# EAGLE design a4989_smoothiebrain_daughterboard (EAGLE 7.5.0)
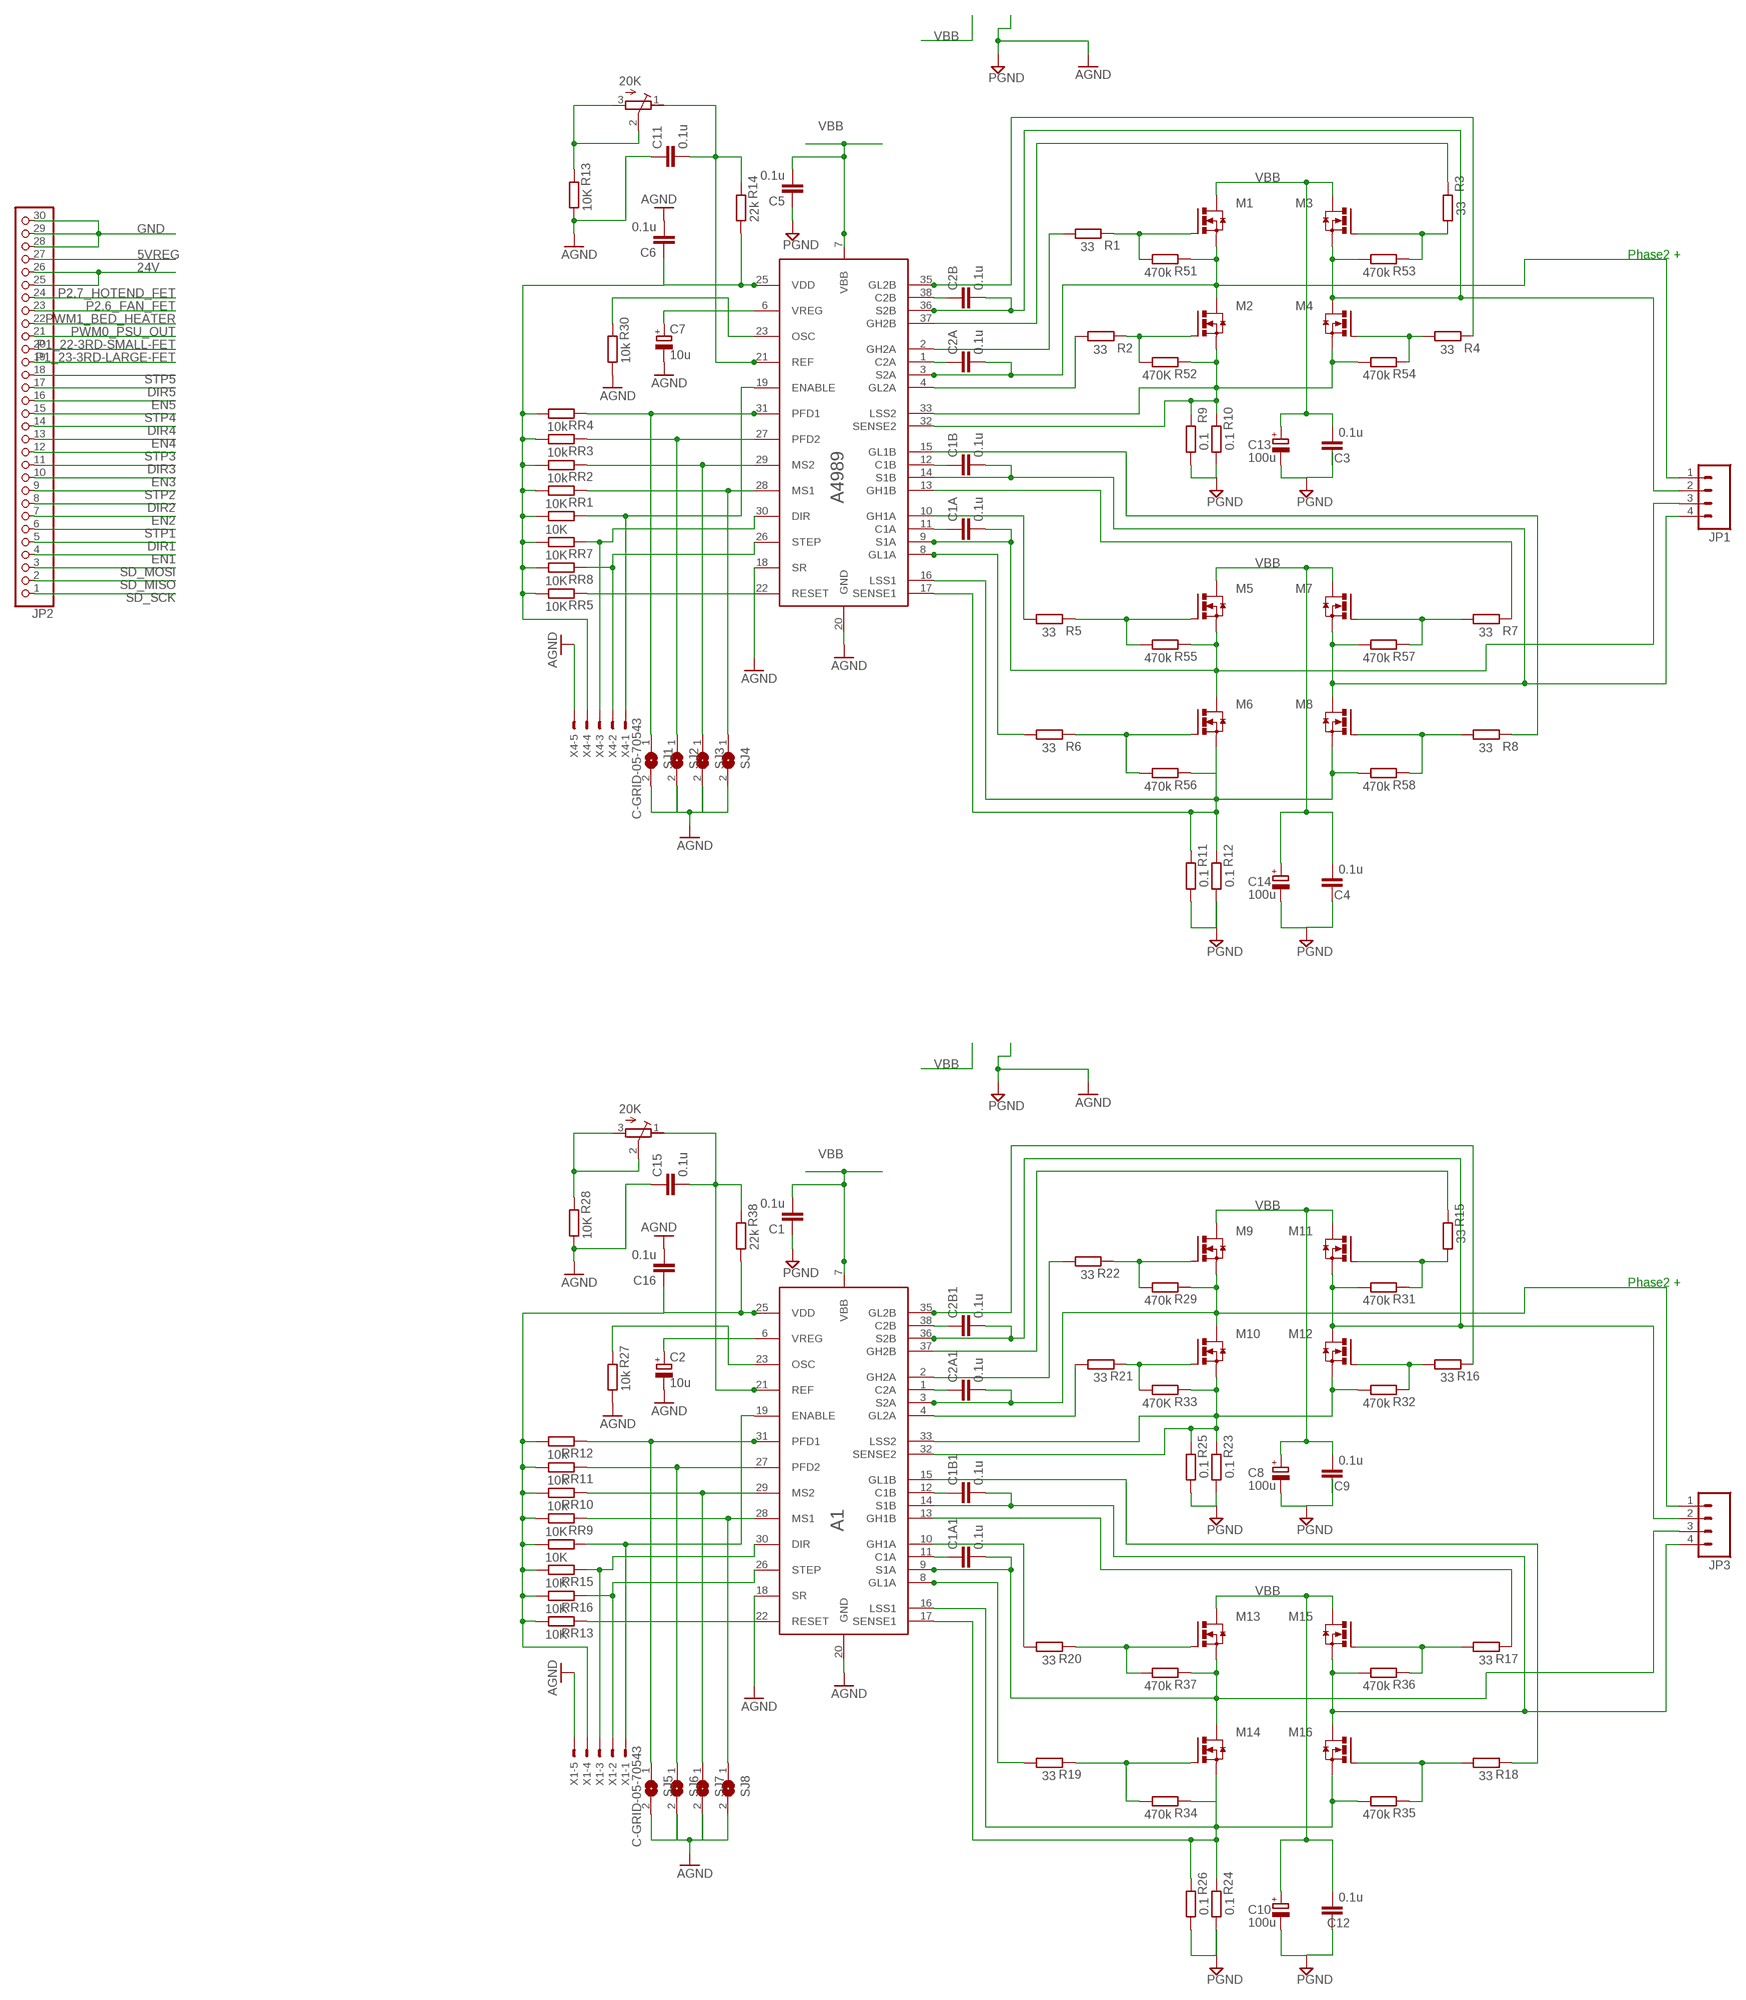
[diagram p0: schematic, sheet 1]

## Parts
A1  A4989  [TSSOP39]
A4989  A4989  [TSSOP39]
C1  0.1u  C-EUC0603  [C0603]
C1A  0.1u  C-EUC0603  [C0603]
C1A1  0.1u  C-EUC0603  [C0603]
C1B  0.1u  C-EUC0603  [C0603]
C1B1  0.1u  C-EUC0603  [C0603]
C2  10u  CPOL-EU153CLV-0605  [153CLV-0605]
C2A  0.1u  C-EUC0603  [C0603]
C2A1  0.1u  C-EUC0603  [C0603]
C2B  0.1u  C-EUC0603  [C0603]
C2B1  0.1u  C-EUC0603  [C0603]
C3  0.1u  C-EUC0603  [C0603]
C4  0.1u  C-EUC0603  [C0603]
C5  0.1u  C-EUC0603  [C0603]
C6  0.1u  C-EUC0603  [C0603]
C7  10u  CPOL-EU153CLV-0605  [153CLV-0605]
C8  100u  CPOL-EUE5-10.5  [E5-10,5]
C9  0.1u  C-EUC0603  [C0603]
C10  100u  CPOL-EUE5-10.5  [E5-10,5]
C11  0.1u  C-EUC0603  [C0603]
C12  0.1u  C-EUC0603  [C0603]
C13  100u  CPOL-EUE5-10.5  [E5-10,5]
C14  100u  CPOL-EUE5-10.5  [E5-10,5]
C15  0.1u  C-EUC0603  [C0603]
C16  0.1u  C-EUC0603  [C0603]
JP1  M04SCREW  [SCREWTERMINAL-3.5MM-4]
JP2  PINHD-1X30  [1X30]
JP3  M04SCREW  [SCREWTERMINAL-3.5MM-4]
M1  IRLR024N  [TO252]
M2  IRLR024N  [TO252]
M3  IRLR024N  [TO252]
M4  IRLR024N  [TO252]
M5  IRLR024N  [TO252]
M6  IRLR024N  [TO252]
M7  IRLR024N  [TO252]
M8  IRLR024N  [TO252]
M9  IRLR024N  [TO252]
M10  IRLR024N  [TO252]
M11  IRLR024N  [TO252]
M12  IRLR024N  [TO252]
M13  IRLR024N  [TO252]
M14  IRLR024N  [TO252]
M15  IRLR024N  [TO252]
M16  IRLR024N  [TO252]
R1  33  R-EU_R0603  [R0603]
R2  33  R-EU_R0603  [R0603]
R3  33  R-EU_R0603  [R0603]
R4  33  R-EU_R0603  [R0603]
R5  33  R-EU_R0603  [R0603]
R6  33  R-EU_R0603  [R0603]
R7  33  R-EU_R0603  [R0603]
R8  33  R-EU_R0603  [R0603]
R9  0.1  R-EU_R2512  [R2512]
R10  0.1  R-EU_R2512  [R2512]
R11  0.1  R-EU_R2512  [R2512]
R12  0.1  R-EU_R2512  [R2512]
R13  10K  R-EU_R0603  [R0603]
R14  22k  R-EU_R0603  [R0603]
R15  33  R-EU_R0603  [R0603]
R16  33  R-EU_R0603  [R0603]
R17  33  R-EU_R0603  [R0603]
R18  33  R-EU_R0603  [R0603]
R19  33  R-EU_R0603  [R0603]
R20  33  R-EU_R0603  [R0603]
R21  33  R-EU_R0603  [R0603]
R22  33  R-EU_R0603  [R0603]
R23  0.1  R-EU_R2512  [R2512]
R24  0.1  R-EU_R2512  [R2512]
R25  0.1  R-EU_R2512  [R2512]
R26  0.1  R-EU_R2512  [R2512]
R27  10k  R-EU_R0603  [R0603]
R28  10K  R-EU_R0603  [R0603]
R29  470k  R-EU_R0603  [R0603]
R30  10k  R-EU_R0603  [R0603]
R31  470k  R-EU_R0603  [R0603]
R32  470k  R-EU_R0603  [R0603]
R33  470K  R-EU_R0603  [R0603]
R34  470k  R-EU_R0603  [R0603]
R35  470k  R-EU_R0603  [R0603]
R36  470k  R-EU_R0603  [R0603]
R37  470k  R-EU_R0603  [R0603]
R38  22k  R-EU_R0603  [R0603]
R51  470k  R-EU_R0603  [R0603]
R52  470K  R-EU_R0603  [R0603]
R53  470k  R-EU_R0603  [R0603]
R54  470k  R-EU_R0603  [R0603]
R55  470k  R-EU_R0603  [R0603]
R56  470k  R-EU_R0603  [R0603]
R57  470k  R-EU_R0603  [R0603]
R58  470k  R-EU_R0603  [R0603]
RR1  10K  R-EU_R0603  [R0603]
RR2  10k  R-EU_R0603  [R0603]
RR3  10k  R-EU_R0603  [R0603]
RR4  10k  R-EU_R0603  [R0603]
RR5  10K  R-EU_R0603  [R0603]
RR6  10K  R-EU_R0603  [R0603]
RR7  10K  R-EU_R0603  [R0603]
RR8  10K  R-EU_R0603  [R0603]
RR9  10K  R-EU_R0603  [R0603]
RR10  10k  R-EU_R0603  [R0603]
RR11  10k  R-EU_R0603  [R0603]
RR12  10k  R-EU_R0603  [R0603]
RR13  10K  R-EU_R0603  [R0603]
RR14  10K  R-EU_R0603  [R0603]
RR15  10K  R-EU_R0603  [R0603]
RR16  10K  R-EU_R0603  [R0603]
SJ1  SJ  [SJ]
SJ2  SJ  [SJ]
SJ3  SJ  [SJ]
SJ4  SJ  [SJ]
SJ5  SJ  [SJ]
SJ6  SJ  [SJ]
SJ7  SJ  [SJ]
SJ8  SJ  [SJ]
U$1  20K  BOURNS_TRIMMER_3266W  [BOURNS_3266W]
U$2  20K  BOURNS_TRIMMER_3266W  [BOURNS_3266W]
X1  C-GRID-05-70543  [70543-05]
X4  C-GRID-05-70543  [70543-05]

## Nets
5VREG: A4989.25(VDD) C6.1 JP2.27 R14.2 RR1.2 RR2.2 RR3.2 RR4.2 RR5.2 RR6.2 RR7.2 RR8.2 X4.4
5VREG1: A1.25(VDD) C16.1 R38.2 RR9.2 RR10.2 RR11.2 RR12.2 RR13.2 RR14.2 RR15.2 RR16.2 X1.4
24V: JP2.25 JP2.26
DIR1: A4989.30(DIR) JP2.5 RR7.1 X4.3
DIR2: JP2.8
DIR3: JP2.11
DIR4: JP2.14
DIR5: JP2.17
DIR6: A1.30(DIR) RR15.1 X1.3
EN1: A4989.19(ENABLE) JP2.4 RR6.1 X4.1
EN2: JP2.7
EN3: JP2.10
EN4: JP2.13
EN5: JP2.16
EN6: A1.19(ENABLE) RR14.1 X1.1
GH1A: A4989.10(GH1A) R5.2
GH1A1: A1.10(GH1A) R20.2
GH1B: A4989.13(GH1B) R7.1
GH1B1: A1.13(GH1B) R17.1
GH2A: A4989.2(GH2A) R1.2
GH2A1: A1.2(GH2A) R22.2
GH2B: A4989.37(GH2B) R3.1
GH2B1: A1.37(GH2B) R15.1
GL1A: A4989.8(GL1A) R6.2
GL1A1: A1.8(GL1A) R19.2
GL1B: A4989.15(GL1B) R8.1
GL1B1: A1.15(GL1B) R18.1
GL2A: A4989.4(GL2A) R2.2
GL2A1: A1.4(GL2A) R21.2
GL2B: A4989.35(GL2B) R4.1
GL2B1: A1.35(GL2B) R16.1
GND: A1.18(SR) A1.20(GND) A4989.18(SR) A4989.20(GND) C1.1 C2.- C3.1 C4.1 C5.1 C6.2 C7.- C8.- C9.1 C10.- C11.1 C12.1 C13.- C14.- C15.1 C16.2 JP2.28 JP2.29 JP2.30 R9.2 R10.2 R11.2 R12.2 R13.2 R23.2 R24.2 R25.2 R26.2 R27.2 R28.2 R30.2 SJ1.2 SJ2.2 SJ3.2 SJ4.2 SJ5.2 SJ6.2 SJ7.2 SJ8.2 X1.5 X4.5 ; supply symbol labelled PGND, AGND
LSS1: A4989.16(LSS1) A4989.17(SENSE1) M6.2(S) M8.2(S) R11.1 R12.1 R56.1 R58.2
LSS2: A4989.32(SENSE2) A4989.33(LSS2) M2.2(S) M4.2(S) R9.1 R10.1 R52.1 R54.2
LSS3: A1.32(SENSE2) A1.33(LSS2) M10.2(S) M12.2(S) R23.1 R25.1 R32.2 R33.1
LSS4: A1.16(LSS1) A1.17(SENSE1) M14.2(S) M16.2(S) R24.1 R26.1 R34.1 R35.2
MS1: A4989.28(MS1) RR1.1 SJ4.1
MS2: A4989.29(MS2) RR2.1 SJ3.1
MS3: A1.29(MS2) RR10.1 SJ7.1
MS4: A1.28(MS1) RR9.1 SJ8.1
N$1: M10.1(G) R21.1 R33.2
N$2: M9.1(G) R22.1 R29.2
N$3: M11.1(G) R15.2 R31.1
N$4: M12.1(G) R16.2 R32.1
N$5: M14.1(G) R19.1 R34.2
N$6: M2.1(G) R2.1 R52.2
N$7: M1.1(G) R1.1 R51.2
N$8: M3.1(G) R3.2 R53.1
N$9: M4.1(G) R4.2 R54.1
N$10: M6.1(G) R6.1 R56.2
N$11: M5.1(G) R5.1 R55.2
N$12: M7.1(G) R7.2 R57.1
N$13: M8.1(G) R8.2 R58.1
N$14: M13.1(G) R20.1 R37.2
N$15: M15.1(G) R17.2 R36.1
N$16: R13.1 U$1.2(S) U$1.3(E)
N$17: M16.1(G) R18.2 R35.1
N$18: A4989.22(RESET) RR5.1
N$19: A1.12(C1B) C1B1.1
N$20: A1.11(C1A) C1A1.1
N$21: A1.1(C2A) C2A1.1
N$22: A1.38(C2B) C2B1.1
N$23: R28.1 U$2.2(S) U$2.3(E)
N$24: A1.22(RESET) RR13.1
N$31: A4989.12(C1B) C1B.1
N$34: A4989.11(C1A) C1A.1
N$35: A4989.1(C2A) C2A.1
N$36: A4989.38(C2B) C2B.1
OSC: A4989.23(OSC) R30.1
OSC1: A1.23(OSC) R27.1
P1+: A4989.9(S1A) C1A.2 JP1.3 M5.2(S) M6.3(D) R55.1
P1+1: A1.9(S1A) C1A1.2 JP3.3 M13.2(S) M14.3(D) R37.1
P1-: A4989.14(S1B) C1B.2 JP1.4 M7.2(S) M8.3(D) R57.2
P1-1: A1.14(S1B) C1B1.2 JP3.4 M15.2(S) M16.3(D) R36.2
P1_22-3RD-SMALL-FET: JP2.20
P1_23-3RD-LARGE-FET: JP2.19
P2+: A4989.3(S2A) C2A.2 JP1.1 M1.2(S) M2.3(D) R51.1
P2+1: A1.3(S2A) C2A1.2 JP3.1 M9.2(S) M10.3(D) R29.1
P2-: A4989.36(S2B) C2B.2 JP1.2 M3.2(S) M4.3(D) R53.2
P2-1: A1.36(S2B) C2B1.2 JP3.2 M11.2(S) M12.3(D) R31.2
P2.6_FAN_FET: JP2.23
P2.7_HOTEND_FET: JP2.24
PFD1: A4989.31(PFD1) RR4.1 SJ1.1
PFD2: A4989.27(PFD2) RR3.1 SJ2.1
PFD3: A1.31(PFD1) RR12.1 SJ5.1
PFD4: A1.27(PFD2) RR11.1 SJ6.1
PWM0_PSU_OUT: JP2.21
PWM1_BED_HEATER: JP2.22
REF: A4989.21(REF) C11.2 R14.1 U$1.1(A)
REF1: A1.21(REF) C15.2 R38.1 U$2.1(A)
SD_MISO: JP2.2
SD_MOSI: JP2.3
SD_SCK: JP2.1
STP1: A4989.26(STEP) JP2.6 RR8.1 X4.2
STP2: JP2.9
STP3: JP2.12
STP4: JP2.15
STP5: JP2.18
STP6: A1.26(STEP) RR16.1 X1.2
VBB: A1.7(VBB) A4989.7(VBB) C1.2 C3.2 C4.2 C5.2 C8.+ C9.2 C10.+ C12.2 C13.+ C14.+ M1.3(D) M3.3(D) M5.3(D) M7.3(D) M9.3(D) M11.3(D) M13.3(D) M15.3(D)
VREG: A4989.6(VREG) C7.+
VREG1: A1.6(VREG) C2.+

## Notes on the sheet
- Phase2 +
- Phase2 +

## Library data of the parts
A1 A4989 = myLib:A4989
C1 C1A C1A1 C1B C1B1 C2A C2A1 C2B C2B1 C3-C6 C9 C11 C12 C15 C16 = resistor:C-EU: CAPACITOR, European symbol
C2 C7 C8 C10 C13 C14 = rcl:CPOL-EU: POLARIZED CAPACITOR, European symbol
JP1 JP3 = SparkFun-Connectors:M04: Header 4 Standard 4-pin 0.1" header. Use with straight break away headers (SKU : PRT-00116), right angle break away headers (PRT-00553), swiss pins (PRT-00743), machine pins (PRT-00117), and female headers (PRT-00115). Molex polarized connector foot print use with SKU : PRT-08231 with associated crimp pins and housings. 1MM SMD Version SKU: PRT-10208; PROD_ID: Combine 2x8399
JP2 = pinhead:PINHD-1X30: PIN HEADER
M1-M16 = to252(1):IRLR024N
R1-R38 R51-R58 RR1-RR16 = resistor:R-EU_: RESISTOR, European symbol
SJ1-SJ8 = jumper:SJ: SMD solder JUMPER
U$1 U$2 = myLib:BOURNS_TRIMMER_3266W
X1 X4 = con-molex:C-GRID-05: CONNECTOR wire to board 2.54 mm (0.100") pitch header; OC_FARNELL: unknown; OC_NEWARK: unknown

## Net classes
1 power: width 0.6 mm, clearance 0.305 mm

## Board
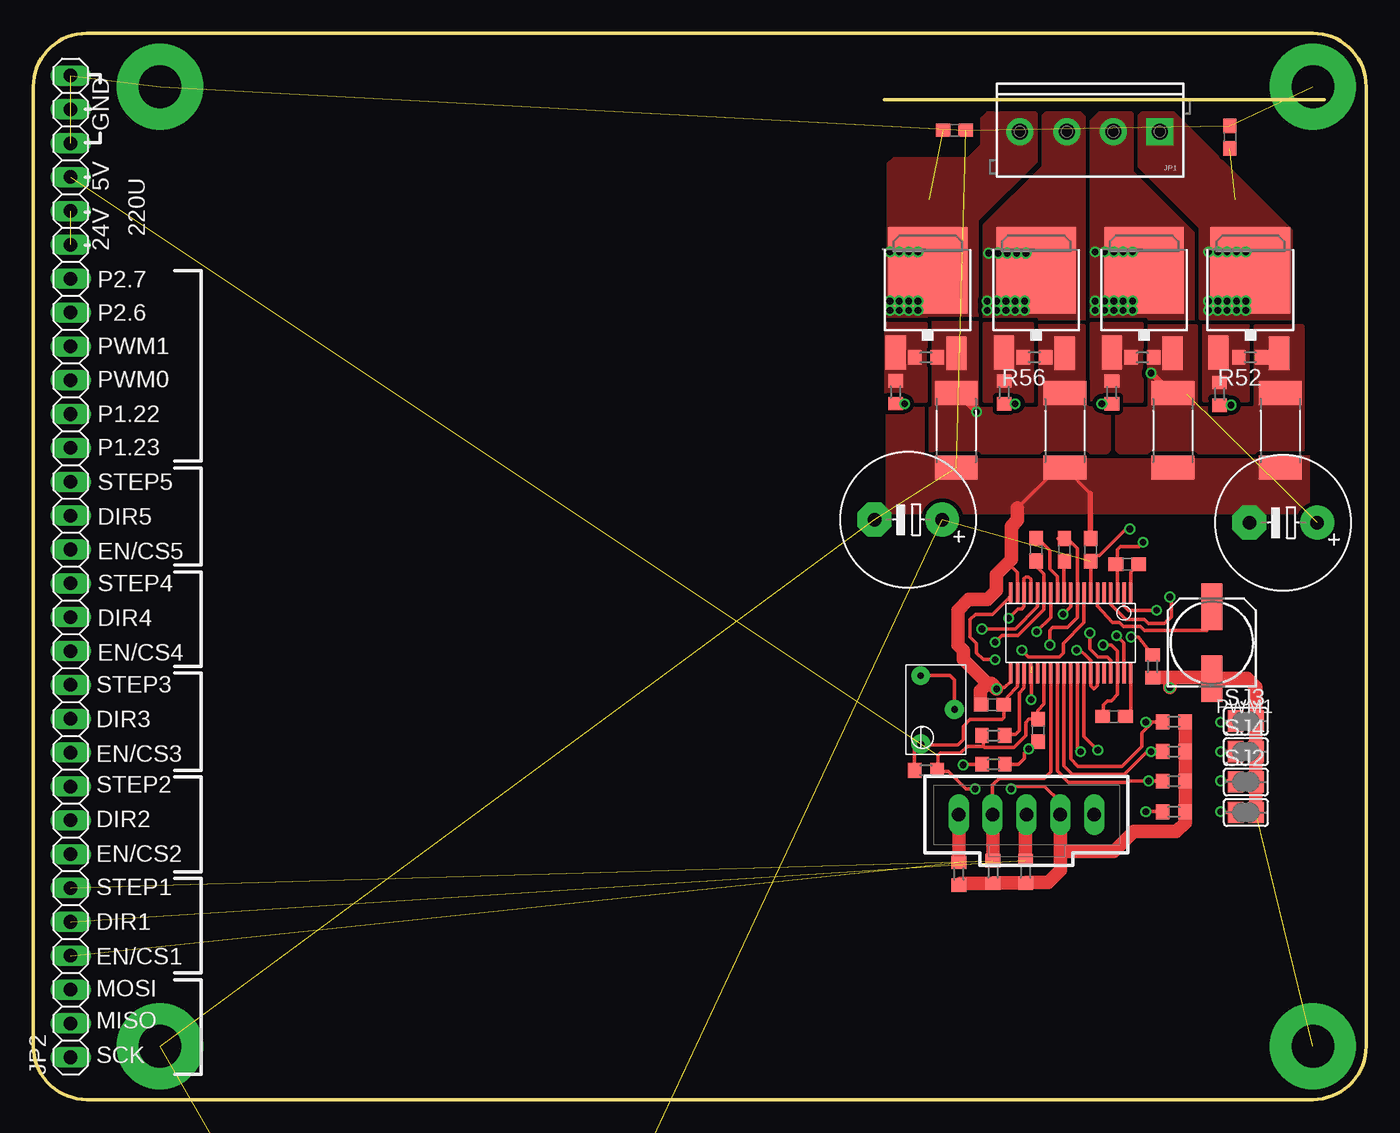
[diagram p1: board, top side]
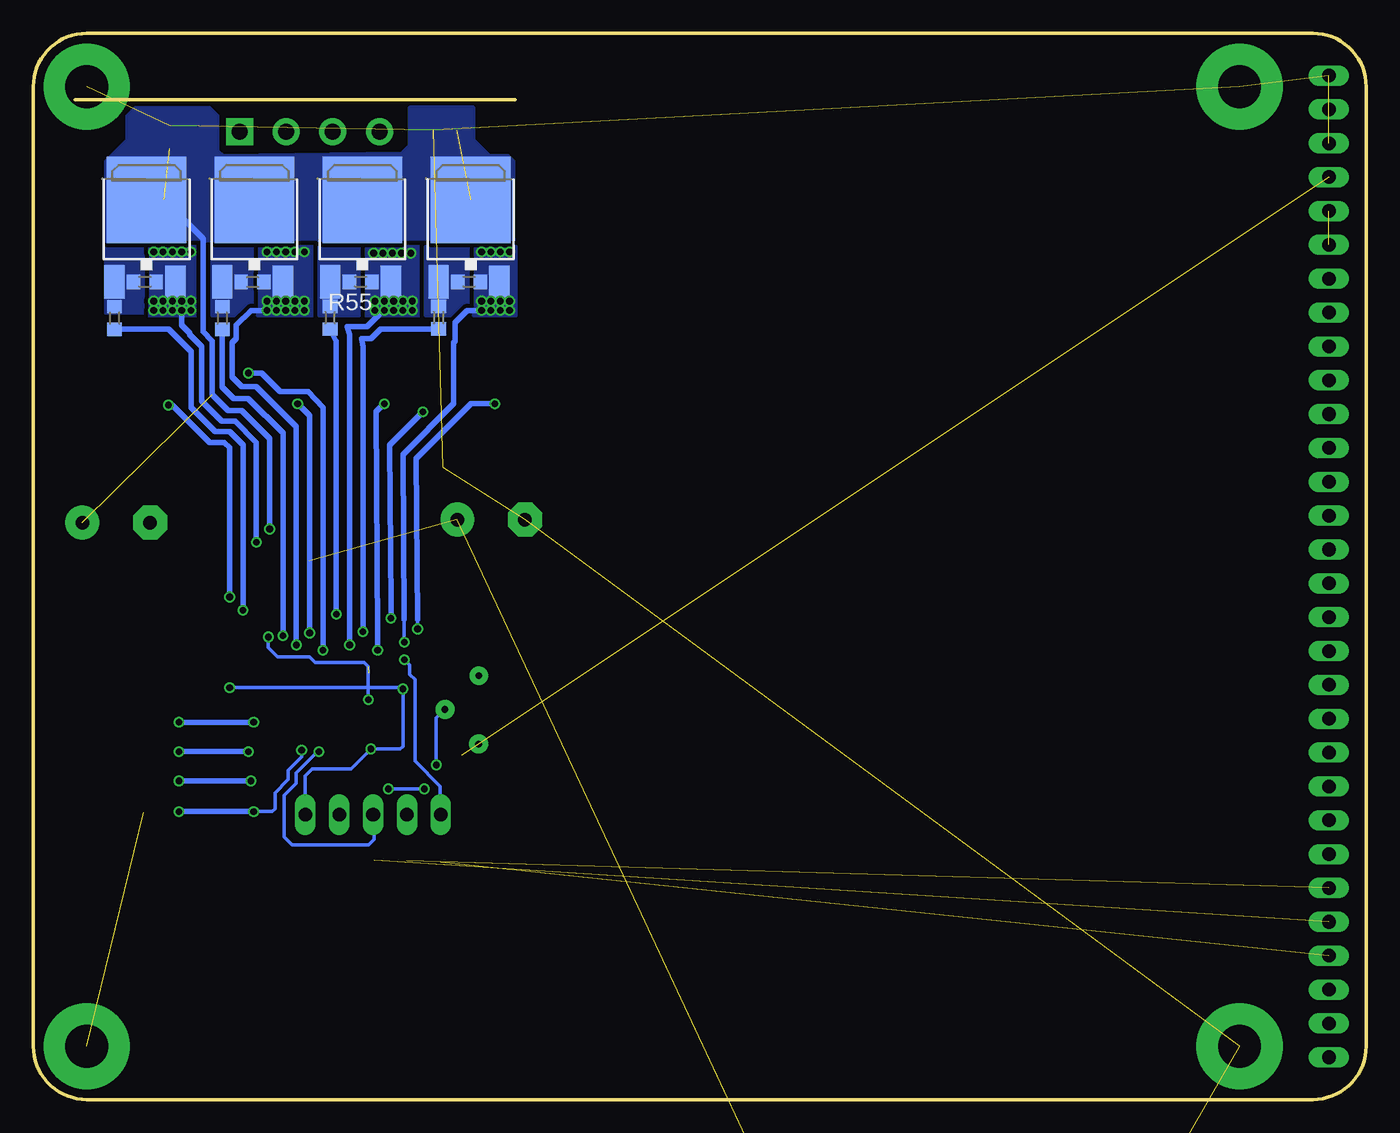
[diagram p2: board, bottom side, seen from below]

Size 100 x 80 mm. Coordinates in mm from the lower left corner, seen from the top.
Outline: 96.87,75.01 63.87,75.01
Outline: 4,0 96,0 arc90 100,4 100,76 arc90 96,80 4,80 arc90 0,76 0,4 arc90 4,0
Copper layers (1*16): Top 0.035mm / dielectric 1.5mm / Bottom 0.035mm
Design rules "dirt_cheap_dirty_boards.v1": minimum track width 5mil, minimum drill 12mil, track to track 5mil, track to pad 5mil, pad to pad 5mil, via to via 5mil, smd to smd 0mil, copper to edge 10mil, drill to drill 10mil, minimum pad ring 10mil, minimum via ring 6mil, stop-mask expansion 2mil, vias tented up to drill 25mil, thermal gap 10mil

### Footprints (pad centres in the part's own frame; a part is rotated, then mirrored left to right if it is on the bottom)
TSSOP39 = smd 0.254 x 1.6: 1 -4.5,-3; 2 -4,-3; 3 -3.5,-3; 4 -3,-3; 5 -2.5,-3; 6 -2,-3; 7 -1.5,-3; 8 -1,-3; 9 -0.5,-3; 10 0,-3; 11 0.5,-3; 12 1,-3; 13 1.5,-3; 14 2,-3; 15 2.5,-3; 16 3,-3; 17 3.5,-3; 18 4,-3; 19 4.5,-3; 20 4.5,3; 21 4,3; 22 3.5,3; 23 3,3; 24 2.5,3; 25 2,3; 26 1.5,3; 27 1,3; 28 0.5,3; 29 0,3; 30 -0.5,3; 31 -1,3; 32 -1.5,3; 33 -2,3; 34 -2.5,3; 35 -3,3; 36 -3.5,3; 37 -4,3; 38 -4.5,3
C0603 = smd 1.1 x 1: 1 -0.85,0; 2 0.85,0
153CLV-0605 = smd 3.5 x 1.6: + 2.7,0; - -2.7,0
E5-10,5 = drill 1.016 pad 2.54: + -2.54,0 | drill 1.016 pad 2.54 octagon: - 2.54,0
SCREWTERMINAL-3.5MM-4 = drill 1.2 pad 2.032 square: 1 0,0 | drill 1.2 pad 2.032: 2 3.5,0; 3 7,0; 4 10.5,0
1X30 = drill 1.016 long: 1 -36.83,0; 2 -34.29,0; 3 -31.75,0; 4 -29.21,0; 5 -26.67,0; 6 -24.13,0; 7 -21.59,0; 8 -19.05,0; 9 -16.51,0; 10 -13.97,0; 11 -11.43,0; 12 -8.89,0; 13 -6.35,0; 14 -3.81,0; 15 -1.27,0; 16 1.27,0; 17 3.81,0; 18 6.35,0; 19 8.89,0; 20 11.43,0; 21 13.97,0; 22 16.51,0; 23 19.05,0; 24 21.59,0; 25 24.13,0; 26 26.67,0; 27 29.21,0; 28 31.75,0; 29 34.29,0; 30 36.83,0
TO252 = smd 1.524 x 2.54: 1 -2.407,-3.657; 2 2.153,-3.72 | smd 5.97 x 6.48: 3 0,2.5
R0603 = smd 1 x 1.1: 1 -0.85,0; 2 0.85,0
R2512 = smd 1.8 x 3.2: 1 -2.8,0; 2 2.8,0
SJ = smd 1.168 x 1.6: 1 -0.762,0; 2 0.762,0
BOURNS_3266W = drill 0.5 pad 1.422: 1 -1.77,1.4; 2 0.83,-1.12; 3 3.36,1.42
70543-05 = drill 1.016 long: 1 -5.08,0; 2 -2.54,0; 3 0,0; 4 2.54,0; 5 5.08,0

### Placement (x,y rotation side)
A1  48,-69.4 0 top  (outside the outline)
A4989  77.84,35.01 180 top
C1  45.2,-96 0 top  (outside the outline)
C1A  77.36,41.24 90 top
C1A1  22.8,-96 0 top  (outside the outline)
C1B  75.23,41.25 270 top
C1B1  28.4,-96 0 top  (outside the outline)
C2  48.2,-58.5 0 top  (outside the outline)
C2A  82.07,40.16 180 top
C2A1  34,-96 0 top  (outside the outline)
C2B  81.08,28.74 180 top
C2B1  39.6,-96 0 top  (outside the outline)
C3  89.77,72.21 270 top
C4  69.11,72.73 180 top
C5  79.32,41.24 270 top
C6  75.38,27.69 270 top
C7  88.42,34.28 90 top
C8  18.2,-70.7 0 top  (outside the outline)
C9  49.8,-96 0 top  (outside the outline)
C10  4.5,-70.7 0 top  (outside the outline)
C11  71.95,29.63 0 top
C12  0.8,-101.2 0 top  (outside the outline)
C13  93.78,43.29 180 top
C14  65.65,43.51 180 top
C15  5.4,-101.2 0 top  (outside the outline)
C16  10,-101.2 0 top  (outside the outline)
JP1  84.53,72.63 180 top
JP2  2.8,40 90 top
JP3  33.7,-79.4 0 top  (outside the outline)
M1  91.5,65.01 0 bottom
M2  91.31,59.71 0 top
M3  83.42,65.01 0 bottom
M4  83.33,59.71 0 top
M5  75.32,65.01 0 bottom
M6  75.23,59.71 0 top
M7  67.19,65.01 0 bottom
M8  67.1,59.71 0 top
M9  4.8,-47.1 0 top  (outside the outline)
M10  15.9,-47.1 0 top  (outside the outline)
M11  27,-47.1 0 top  (outside the outline)
M12  38.1,-47.1 0 top  (outside the outline)
M13  4.8,-59.5 0 top  (outside the outline)
M14  15.9,-59.5 0 top  (outside the outline)
M15  27,-59.5 0 top  (outside the outline)
M16  38.1,-59.5 0 top  (outside the outline)
R1  93.9,58.65 270 bottom
R2  89.01,52.95 270 top
R3  85.82,58.64 90 bottom
R4  80.92,53.06 90 top
R5  77.73,58.66 270 bottom
R6  72.83,53.06 270 top
R7  69.59,58.67 90 bottom
R8  64.69,53.06 90 top
R9  85.5,50.21 270 top
R10  93.56,50.21 270 top
R11  77.39,50.2 270 top
R12  69.24,50.22 270 top
R13  72.04,25.15 0 top
R14  66.97,24.69 0 top
R15  25.5,-91 0 top  (outside the outline)
R16  29.9,-91 0 top  (outside the outline)
R17  34.3,-91 0 top  (outside the outline)
R18  38.7,-91 0 top  (outside the outline)
R19  43.1,-91 0 top  (outside the outline)
R20  47.5,-91 0 top  (outside the outline)
R21  0.8,-96.2 0 top  (outside the outline)
R22  5.2,-96.2 0 top  (outside the outline)
R23  3.3,-79.5 0 top  (outside the outline)
R24  11.3,-79.5 0 top  (outside the outline)
R25  19.3,-79.5 0 top  (outside the outline)
R26  27.3,-79.5 0 top  (outside the outline)
R27  9.6,-96.2 0 top  (outside the outline)
R28  14,-96.2 0 top  (outside the outline)
R29  40.3,-85.8 0 top  (outside the outline)
R30  83.97,32.51 270 top
R31  45.3,-85.8 0 top  (outside the outline)
R32  50.3,-85.8 0 top  (outside the outline)
R33  35,-85.8 0 top  (outside the outline)
R34  0.8,-91 0 top  (outside the outline)
R35  5.8,-91 0 top  (outside the outline)
R36  10.8,-91 0 top  (outside the outline)
R37  15.8,-91 0 top  (outside the outline)
R38  18.4,-96.2 0 top  (outside the outline)
R51  91.63,61.36 180 bottom
R52  91.29,55.69 180 top
R53  83.56,61.35 0 bottom
R54  83.21,55.69 0 top
R55  75.44,61.35 180 bottom
R56  75.1,55.69 180 top
R57  67.31,61.35 0 bottom
R58  66.97,55.69 0 top
RR1  85.57,26.12 0 top
RR2  85.57,28.33 0 top
RR3  85.57,23.89 0 top
RR4  85.57,21.58 0 top
RR5  72.02,27.31 180 top
RR6  69.44,16.94 270 top
RR7  74.45,17.09 270 top
RR8  72,17.06 270 top
RR9  20.8,-91 0 top  (outside the outline)
RR10  48.1,-78.5 0 top  (outside the outline)
RR11  0.8,-85.8 0 top  (outside the outline)
RR12  6.5,-85.8 0 top  (outside the outline)
RR13  12.2,-85.8 0 top  (outside the outline)
RR14  17.9,-85.8 0 top  (outside the outline)
RR15  23.6,-85.8 0 top  (outside the outline)
RR16  29.3,-85.8 0 top  (outside the outline)
SJ1  90.97,21.54 0 top
SJ2  90.97,23.83 0 top
SJ3  90.97,28.39 0 top
SJ4  90.97,26.1 0 top
SJ5  22.9,-101.6 0 top  (outside the outline)
SJ6  27,-101.6 0 top  (outside the outline)
SJ7  31.1,-101.6 0 top  (outside the outline)
SJ8  35.2,-101.6 0 top  (outside the outline)
U$1  68,28.44 90 top
U$2  16.3,-101.4 0 top  (outside the outline)
X1  35.3,-70.1 0 top  (outside the outline)
X4  74.51,21.37 0 top

### Tracks (layer width: path | path; a pad name or v marks a point on that pad's centre or on a via)
5VREG  (via drill 0.5)  (1 unrouted)
  Top 0.254: 71.27,26.51 71.37,26.41 73.57,26.41 74.47,27.31 74.47,28.31 74.7,28.54 C6.1 75.37,28.56 75.37,29.21 75.84,29.68 A4989.25 | 71.27,26.51 71.27,27.21 RR5.2 | 74.52,16.31 RR7.2 | 72.03,16.24 RR8.2 | 69.56,16.21 RR6.2 | 71.27,26.51 70.07,26.51 69.57,26.01 68.07,26.01 67.87,25.81 67.87,24.74 R14.2 67.91,24.61 68.67,24.61 69.97,23.31 v70.67,23.31 | X4.4 77.05,22.33 75.87,23.51 73.57,23.51 v73.37,23.31 | 77.15,19.01 77.05,19.51
  Top 1.016: X4.4 77.05,19.51 77.05,18.51 | 77.05,18.51 77.05,17.19 76.17,16.31 74.52,16.31 | RR7.2 72.03,16.24 | RR8.2 69.56,16.21 | RR2.2 RR1.2 RR3.2 RR4.2 86.42,20.76 85.77,20.11 82.57,20.11 81.07,18.61 77.15,18.61 77.05,18.51
  Bottom 0.254: v73.37,23.31 v70.67,23.31
5VREG1  (11 unrouted)
24V  (1 unrouted)
DIR1  (via drill 0.5)  (1 unrouted)
  Top 0.254: A4989.30 78.34,26.34 v78.57,26.11 | 74.45,21.31 X4.3
  Top 1.016: RR7.1 74.45,21.31
  Bottom 0.254: 74.57,21.43 X4.3 74.45,21.31 74.45,19.51 74.85,19.11 80.57,19.11 81.17,19.71 81.17,22.81 80.27,23.71 80.27,24.51 78.67,26.11 v78.57,26.11
DIR6  (2 unrouted)
EN1  (via drill 0.5)  (1 unrouted)
  Top 0.254: A4989.19 73.34,37.78 71.97,36.41 70.67,36.41 70.27,36.01 70.27,34.71 70.77,34.21 70.77,33.51 71.27,33.01 v72.17,33.01 | X4.1
  Top 1.016: RR6.1 X4.1
  Bottom 0.254: X4.1 69.47,21.41 69.47,23.51 71.37,25.41 71.37,31.51 71.77,31.91 71.77,32.61 v72.17,33.01
EN6  (2 unrouted)
GH1A  (via drill 0.5)
  Top 0.254: A4989.10 77.84,36.98 v77.27,36.41
  Bottom 0.406: R5.2 77.73,57.77 77.27,56.91 v77.27,36.41
GH1A1  (1 unrouted)
GH1B  (via drill 0.5)
  Top 0.254: A4989.13 76.34,36.18 v75.27,35.11
  Bottom 0.406: R7.1 73.95,57.83 74.67,57.11 75.37,57.11 75.27,56.51 v75.27,35.11
GH1B1  (1 unrouted)
GH2A  (via drill 0.5)
  Top 0.254: A4989.2 81.84,37.04 82.17,36.71 v84.27,36.71
  Bottom 0.254: v84.27,36.71 84.27,36.91
  Bottom 0.406: R1.2 89.86,57.8 88.17,56.11 88.17,51.91 86.37,50.11 85.27,50.11 84.27,49.11 v84.27,36.71
GH2A1  (1 unrouted)
GH2B  (via drill 0.5)
  Top 0.254: A4989.37 81.84,34.24 v81.27,34.81
  Bottom 0.406: R3.1 85.82,53.46 84.97,52.61 83.87,52.61 81.27,50.01 v81.27,34.81
GH2B1  (1 unrouted)
GL1A  (via drill 0.5)
  Top 0.254: A4989.8 78.84,35.78 77.27,34.21 77.27,33.51 76.97,33.21 74.67,33.21 v74.17,33.71 74.27,33.61
  Top 0.406: R6.2 v73.67,52.21
  Bottom 0.254: v74.17,33.71 74.17,35.21 74.17,34.81
  Bottom 0.406: v74.17,33.71 74.17,34.81 74.27,51.61 v73.67,52.21
GL1A1  (1 unrouted)
GL1B  (via drill 0.5)
  Top 0.254: v71.17,35.31 73.67,35.31 75.34,36.98 A4989.15
  Top 0.406: R8.1 v65.37,52.21
  Bottom 0.254: v71.17,35.31 71.17,36.01
  Bottom 0.406: v65.37,52.21 67.17,52.21 71.27,48.11 71.17,36.01
GL1B1  (1 unrouted)
GL2A  (via drill 0.5)
  Top 0.254: A4989.4 80.84,37.14 81.97,36.01 83.37,36.01 83.67,35.71 84.87,35.71 85.37,36.21 85.37,37.61 v85.27,37.71
  Top 0.406: 88.98,52.1 R2.2 v89.87,52.11
  Bottom 0.406: v85.27,37.71 85.27,48.91 85.67,49.31 86.77,49.31 89.57,52.11 v89.87,52.11
GL2A1  (1 unrouted)
GL2B  (via drill 0.5)
  Top 0.254: A4989.35 80.84,32.94 80.57,33.21 79.87,33.21 79.27,33.81 v79.27,35.01
  Top 0.406: R4.1 v80.17,52.21
  Bottom 0.406: 80.17,52.01 v80.17,52.21 79.27,51.31 v79.27,35.01
GL2B1  (1 unrouted)
GND  (via drill 0.5, 3.2 pad 6.45)  (31 unrouted)
  Top 0.254: 79.32,45.47 R11.2 77.2,47.21 76.67,47.21 73.84,44.38 | 71.07,29.66 C11.1 | A4989.20 73.34,31.38 72.87,30.91 72.37,30.91 v72.27,30.81 72.17,30.91 | C6.2 75.2,26.84 v74.67,26.31 74.37,26.01 74.37,25.61 73.91,25.15 R13.2 | 88.34,31.66 C7.- 88.65,31.81 88.97,31.81 89.17,31.61 | 73.84,38.54 A4989.18 73.84,39.54 73.12,40.26 | 91.73,23.07 92.07,23.41 92.07,23.49 SJ2.2
  Top 0.406: C5.1 79.32,45.47
  Top 1.016: R30.2 85.27,31.66 | 85.27,31.66 88.34,31.66 | SJ1.2 91.73,23.07 | SJ2.2 SJ4.2 SJ3.2 91.73,30.95 91.07,31.61 89.17,31.61 | v85.27,30.91 85.27,31.66 | 73.84,44.38 73.84,43.48 73.37,43.01 73.37,40.51 73.12,40.26 72.27,39.41 72.27,38.21 71.57,37.51 70.17,37.51 69.37,36.71 69.37,34.11 69.77,33.71 69.77,33.01 71.57,31.21 | 71.57,31.21 71.87,31.21 v72.27,30.81 | 71.07,29.66 71.07,30.71 71.57,31.21
  Bottom 0.254: X4.5 79.59,24.29 79.07,24.81 76.17,24.81 v74.67,26.31 72.47,26.31 72.27,26.51 v72.27,30.81 72.37,30.91 v85.27,30.91
  other vias: 96,76 9.5,76 9.5,4 96,4
  pour Top (isolate 0.305, rank 5, no thermals): 95.57,48.41 67.07,48.41 66.77,48.71 66.77,51.81 66.57,52.01 64.17,52.01 64.17,44.11 95.57,44.11
LSS1  (via drill 0.5)
  Top 0.254: v73.17,36.11 73.87,36.81 74.17,36.81 74.34,36.98 A4989.17 74.34,39.08 74.47,39.21 74.67,39.21 74.84,39.04 A4989.16
  Top 0.406: R12.1 69.36,53.02 v70.77,51.61
  Bottom 0.254: v73.17,36.11 73.17,37.11
  Bottom 0.406: v73.17,36.11 73.17,37.11 73.27,49.11 v70.77,51.61
  pour Top (isolate 0.305, rank 3, no thermals): 78.77,58.01 78.77,52.21 79.17,51.81 80.67,51.81 80.67,48.81 80.47,48.61 67.37,48.61 67.37,58.21 70.97,58.21 70.97,52.01 75.17,52.01 75.37,52.21 75.37,58.01
LSS2  (via drill 0.5)
  Top 0.254: v78.27,33.71 78.27,34.01 79.34,32.94 A4989.32 79.34,31.04 79.57,30.81 79.84,31.08 A4989.33
  Top 0.406: R10.1 93.56,52.4 | R9.1 85.37,53.01 v83.87,54.51
  Bottom 0.406: v83.87,54.51 82.87,54.51 81.47,53.11 79.37,53.11 78.27,51.91 v78.27,33.71
  pour Top (isolate 0.305, rank 3, no thermals): 91.77,58.01 91.77,52.01 91.57,51.81 87.37,51.81 87.17,52.01 87.17,58.01 83.57,58.01 83.57,52.11 83.37,51.91 81.57,51.91 81.37,51.71 81.37,48.81 81.57,48.61 95.17,48.61 95.17,58.01
LSS3  (7 unrouted)
LSS4  (7 unrouted)
MS1  (via drill 0.5)
  Top 0.254: A4989.28 77.34,25.04 77.97,24.41 81.87,24.41 83.58,26.12 RR1.1 v83.88,26.12 v83.87,26.11 | v89.07,26.11 SJ4.1
  Bottom 0.406: v83.87,26.11 v89.07,26.11
MS2  (via drill 0.5)
  Top 0.254: A4989.29 77.84,25.54 78.37,25.01 81.67,25.01 83.17,26.51 83.17,27.51 83.99,28.33 RR2.1 83.49,28.33 v83.47,28.31 | v89.07,28.31 90.13,28.31 SJ3.1
  Bottom 0.406: v83.47,28.31 v89.07,28.31
MS3  (2 unrouted)
MS4  (2 unrouted)
N$1  (2 unrouted)
N$2  (2 unrouted)
N$3  (2 unrouted)
N$4  (2 unrouted)
N$5  (2 unrouted)
N$6
  pour Top (isolate 0.305, rank 4, no thermals): 91.17,58.21 87.57,58.21 87.57,52.41 91.17,52.41
N$7
  pour Bottom (isolate 0.305, no thermals): 91.77,64.01 94.57,64.01 94.57,59.01 91.77,59.01
N$8
  pour Bottom (isolate 0.305, no thermals): 86.57,64.01 83.57,64.01 83.57,58.81 86.57,58.81
N$9
  pour Top (isolate 0.305, no thermals): 83.17,52.41 83.17,58.21 79.37,58.21 79.37,52.41
N$10
  pour Top (isolate 0.305, rank 2, no thermals): 74.97,58.21 71.37,58.21 71.37,52.41 74.97,52.41
N$11
  pour Bottom (isolate 0.305, no thermals): 78.57,64.01 75.57,64.01 75.57,58.81 78.57,58.81
N$12
  pour Bottom (isolate 0.305, no thermals): 70.57,64.01 67.37,64.01 67.37,58.81 70.57,58.81
N$13
  pour Top (isolate 0.305, rank 2, no thermals): 66.97,52.41 66.97,58.21 63.97,58.21 63.97,52.41
N$14  (2 unrouted)
N$15  (2 unrouted)
N$16  (via drill 0.5)
  Top 0.254: R13.1 69.81,25.15 v69.77,25.11 | U$1.2 69.11,31.46 68.77,31.81 U$1.3
  Bottom 0.254: v69.77,25.11 69.77,28.61 U$1.2
N$17  (2 unrouted)
N$18
  Top 0.254: RR5.1 72.97,27.41 73.67,27.41 73.97,27.71 73.97,30.51 74.34,30.88 A4989.22
N$19  (1 unrouted)
N$20  (1 unrouted)
N$21  (1 unrouted)
N$22  (1 unrouted)
N$23  (2 unrouted)
N$24  (1 unrouted)
N$31
  Top 0.254: A4989.12 76.84,39.24 76.27,39.81 76.27,41.21 75.27,42.21 75.34,42.11 C1B.1
N$34
  Top 0.254: A4989.11 77.34,39.92 C1A.1
N$35
  Top 0.254: A4989.1 82.34,39.58 C2A.1
N$36
  Top 0.254: A4989.38 82.34,29.15 C2B.1
OSC  (via drill 0.5)  (1 unrouted)
  Top 0.254: 74.87,32.51 v74.87,30.01 | v82.37,34.71 82.92,34.71 R30.1
  Bottom 0.254: v82.37,34.71 82.37,33.91 81.67,33.21 79.27,33.21 78.87,32.81 75.17,32.81 74.87,32.51 v74.87,30.01
OSC1  (1 unrouted)
P1+  (via drill 0.5)
  Top 0.254: v76.27,34.11 76.27,35.21 76.47,35.41 77.57,35.41 78.34,36.18 A4989.9 78.34,41.34 77.57,42.11 76.87,42.11 C1A.2
  Bottom 0.406: v73.67,59.21 74.07,58.91 74.97,58.01 76.47,58.01 76.27,57.41 v76.27,34.11 76.27,34.41
  other vias: 72.97,59.21 72.27,59.21 72.27,59.91 72.97,59.91 73.67,59.91 74.37,59.91 74.47,63.51 73.77,63.51 73.07,63.51 72.37,63.51 71.57,59.91 71.57,59.21 74.37,59.21 71.67,63.51
  pour Bottom (isolate 0.305, rank 2, no thermals): 70.97,58.81 75.17,58.81 75.17,64.01 70.97,64.01
  pour Top (isolate 0.305, rank 3, no thermals): 78.97,58.61 71.37,58.61 71.37,65.61 75.77,70.01 75.77,73.81 75.97,74.01 78.57,74.01 78.97,73.61
P1+1  (5 unrouted)
P1-  (via drill 0.5)
  Top 0.254: v72.17,34.31 72.67,34.81 73.87,34.81 75.84,36.78 A4989.14 75.84,39.44 74.87,40.41 74.94,40.41 C1B.2
  Bottom 0.254: v72.17,34.31 72.17,36.01
  Bottom 0.406: v66.37,59.21 67.47,59.21 68.37,58.31 68.37,56.91 68.47,56.81 68.47,52.21 72.27,48.41 72.17,36.01
  other vias: 65.67,59.21 64.97,59.21 64.27,59.21 64.27,59.91 64.97,59.91 65.67,59.91 66.37,59.91 66.37,63.61 65.67,63.61 64.97,63.61 64.27,63.61
  pour Bottom (isolate 0.305, rank 2, no thermals): 63.77,58.81 66.97,58.81 66.97,64.01 63.77,64.01
  pour Top (isolate 0.305, rank 4, no thermals): 70.97,58.61 70.97,65.81 75.37,70.21 75.37,73.81 75.17,74.01 71.57,74.01 71.17,73.61 71.17,71.61 70.17,70.61 64.57,70.61 64.17,70.21 64.17,58.61
P1-1  (5 unrouted)
P2+  (via drill 0.5)
  Top 0.254: A4989.3 81.34,40.05 | 81.34,40.05 C2A.2 | 81.34,40.05 81.34,41.28 81.57,41.51 82.97,41.51 v83.27,41.81
  Bottom 0.406: v88.87,59.21 88.87,58.11 88.27,57.51 88.27,57.41 87.37,56.51 87.37,52.41 85.87,50.91 84.87,50.91 83.27,49.31 v83.27,41.81
  other vias: 90.97,59.21 90.27,59.21 89.57,59.21 88.87,59.91 89.57,59.91 90.27,59.91 90.97,59.91 90.97,63.61 90.27,63.61 89.57,63.61 88.87,63.61 88.17,59.21 88.17,59.91 88.17,63.61
  pour Bottom (isolate 0.305, rank 2, no thermals): 87.77,58.81 91.37,58.81 91.37,64.01 87.77,64.01
  pour Top (isolate 0.305, no thermals): 94.37,58.61 94.37,65.21 85.57,74.01 83.17,74.01 82.97,73.81 82.97,70.01 87.57,65.41 87.57,58.61
P2+1  (5 unrouted)
P2-  (via drill 0.5)
  Top 0.254: v80.27,34.11 80.87,34.11 81.34,33.64 A4989.36 81.34,30.38 80.87,29.91 80.57,29.91 80.27,29.61 80.27,28.78 C2B.2
  Bottom 0.406: v82.47,59.21 83.67,59.21 84.77,58.11 84.77,57.11 85.07,56.81 85.07,54.21 84.37,53.51 83.27,53.51 80.27,50.51 v80.27,34.11
  other vias: 81.07,59.21 80.37,59.21 82.47,59.91 81.77,59.91 81.07,59.91 80.37,59.91 82.47,63.61 81.77,63.61 81.07,63.61 80.37,63.61 79.67,59.21 79.67,59.91 79.67,63.61 81.77,59.21
  pour Bottom (isolate 0.305, rank 2, no thermals): 78.97,58.81 83.17,58.81 83.17,64.01 78.97,64.01
  pour Top (isolate 0.305, rank 2, no thermals): 87.17,58.61 79.37,58.61 79.37,73.41 79.97,74.01 82.37,74.01 82.57,73.81 82.57,69.81 87.17,65.21
P2-1  (5 unrouted)
PFD1  (via drill 0.5)
  Top 0.254: A4989.31 78.84,27.24 v79.87,26.21 | v83.47,21.61 84.69,21.61 RR4.1 | SJ1.1 89.14,21.54 v89.07,21.61
  Bottom 0.254: v79.87,26.21 79.87,25.71 80.87,24.71 80.87,24.01 81.87,23.01 81.87,21.81 82.07,21.61 v83.47,21.61
  Bottom 0.406: v89.07,21.61 v83.47,21.61
PFD2  (via drill 0.5)
  Top 0.254: A4989.27 76.84,24.64 77.67,23.81 82.07,23.81 82.15,23.89 RR3.1 83.69,23.89 v83.67,23.91 | v89.07,23.91 90.12,23.91 SJ2.1
  Bottom 0.406: v83.67,23.91 v89.07,23.91
PFD3  (2 unrouted)
PFD4  (2 unrouted)
REF
  Top 0.254: A4989.21 73.84,30.98 73.07,30.21 73.07,29.9 C11.2 72.82,29.61 72.82,28.66 72.67,28.51 70.27,28.51 69.77,28.01 69.77,27.01 69.37,26.61 67.37,26.61 | 67.37,26.61 66.65,26.61 U$1.1 | R14.1 66.12,26.56 67.37,26.61
REF1  (3 unrouted)
STP1  (1 unrouted)
  Top 0.254: 72,21.34 X4.2 71.97,23.61 72.47,24.11 75.87,24.11 76.34,24.58 A4989.26
  Top 1.016: RR8.1 72,21.34
STP6  (2 unrouted)
VBB  (via drill 0.5)  (14 unrouted)
  Top 0.254: A4989.7 79.34,40.38 C5.2 79.75,40.81 79.97,40.81 81.97,42.81 v82.27,42.81
  Bottom 0.254: 93.67,67.31 91.7,67.31 M1.3
  Bottom 0.406: M1.3 90.17,67.51 87.27,64.61 87.27,57.61 86.57,56.91 86.57,52.91 85.37,51.71 84.37,51.71 82.27,49.61 v82.27,42.81 | 67.19,66.1 M7.3
  pour Bottom (isolate 0.305, rank 5, no thermals): 63.77,64.41 94.57,64.41 94.57,70.41 92.97,72.01 92.97,73.81 92.37,74.41 86.77,74.41 86.17,73.81 86.17,71.21 85.77,70.81 72.37,71.01 71.77,71.61 71.77,74.41 70.77,75.41 67.97,75.41 66.97,74.41 66.97,72.01 65.77,70.81 64.37,70.81 63.97,70.41 63.97,64.61
VREG
  Top 0.254: A4989.6 79.84,37.04 80.97,35.81 81.47,35.81 81.77,35.51 83.07,35.51 83.37,35.21 88.05,35.21 C7.+
VREG1  (1 unrouted)

### Text on the board
tPlace: GND | 5V | 220U | 24V | P2.7 | P2.6 | PWM1 | PWM0 | P1.22 | P1.23 | STEP5 | DIR5 | EN/CS5 | STEP4 | DIR4 | EN/CS4 | STEP3 | DIR3 | EN/CS3 | STEP2 | DIR2 | EN/CS2 | STEP1 | DIR1 | EN/CS1 | MOSI | MISO | SCK
tNames: PWM1
tValues: P1- | P1+